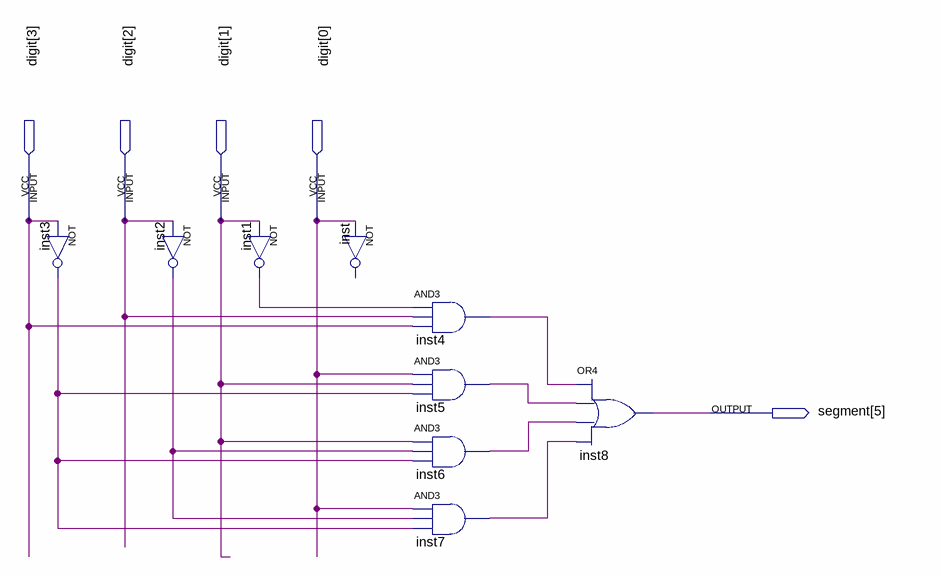
[diagram p0: schematic sheet]
// Quartus schematic segmentF.bdf as structural Verilog: 9 symbols, 5 pins
module segmentF (
  input  [3:0] digit,
  output [5:5] segment
);

  wire inst1_out, inst2_out, inst3_out, inst4_out, inst5_out, inst6_out, inst7_out;

  not inst3 (inst3_out, digit[3]);
  not inst2 (inst2_out, digit[2]);
  not inst1 (inst1_out, digit[1]);
  // NOT inst has open pins: IN=digit[0], OUT=open
  and inst4 (inst4_out, inst1_out, digit[2], digit[3]);
  and inst5 (inst5_out, digit[0], digit[1], inst3_out);
  and inst6 (inst6_out, digit[1], inst2_out, inst3_out);
  and inst7 (inst7_out, digit[0], inst2_out, inst3_out);
  or inst8 (segment[5], inst4_out, inst5_out, inst6_out, inst7_out);
endmodule
